# EAGLE design EasyPlanter(V2) (EAGLE 6.5.0)
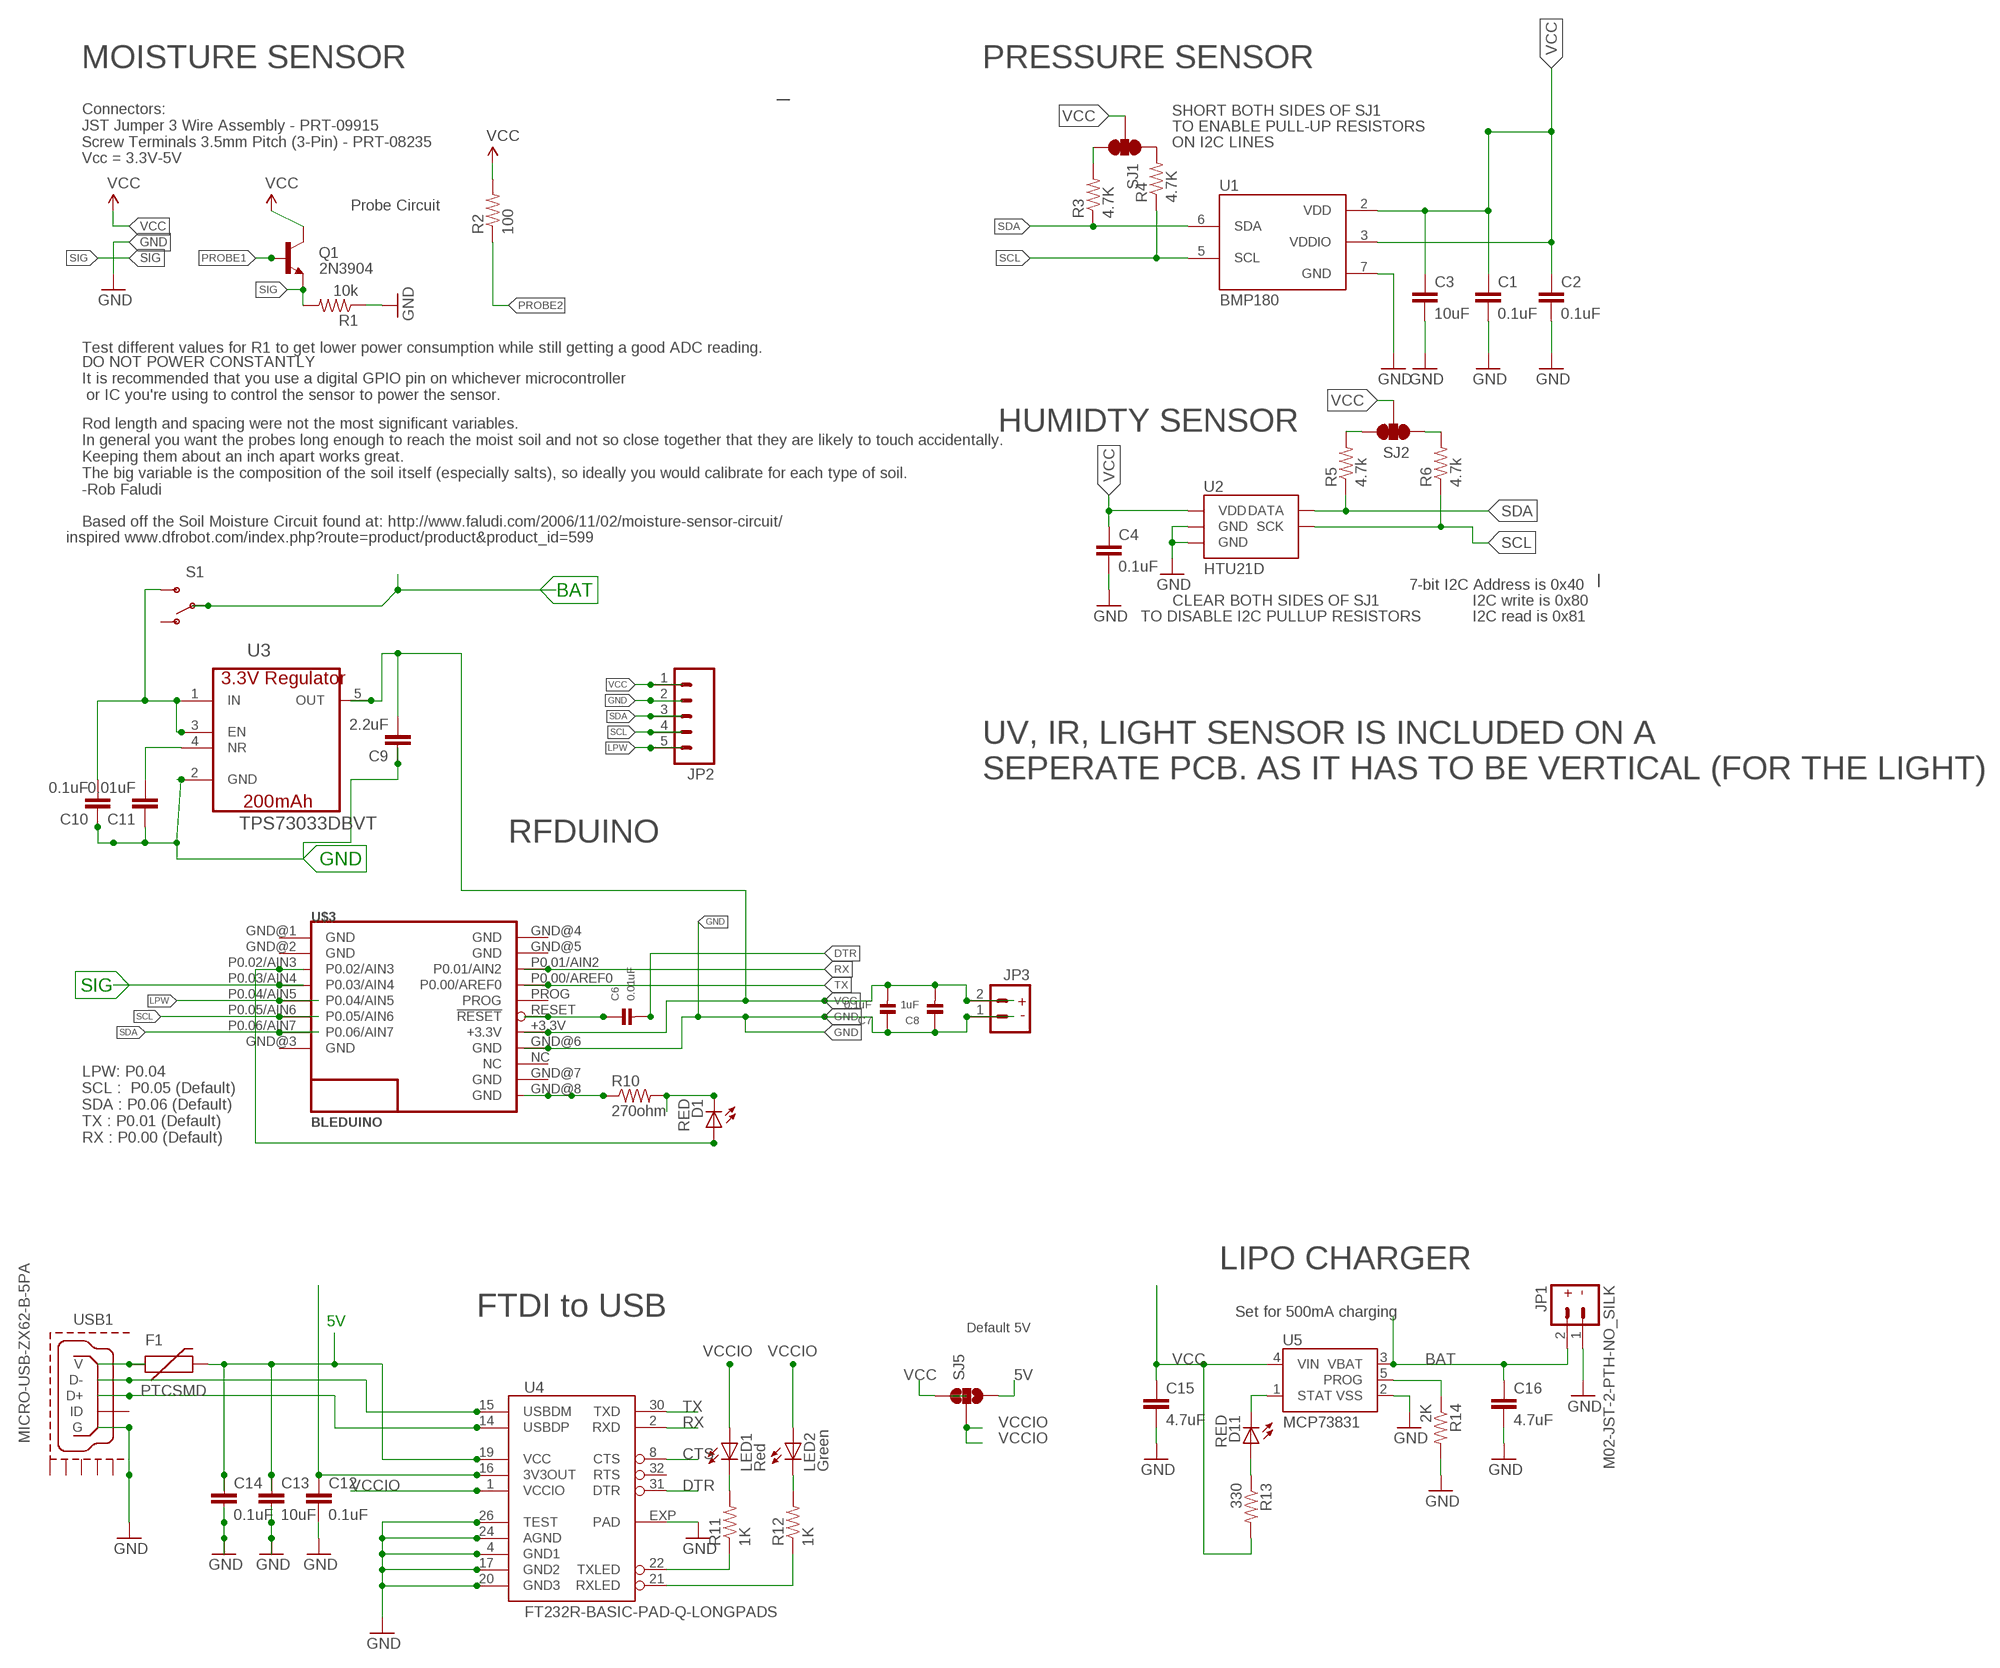
[diagram p0: schematic, sheet 1]

## Parts
C1  0.1uF  CAP0603-CAP  [0603-CAP]
C2  0.1uF  CAP0603-CAP  [0603-CAP]
C3  10uF  CAP0603-CAP  [0603-CAP]
C4  0.1uF  CAP0603-CAP  [0603-CAP]
C6  0.01uF  CAP_CERAMIC0402  [0402]
C7  0.1uF  CAP_CERAMIC0402  [0402]
C8  1uF  CAP_CERAMIC0402  [0402]
C9  2.2uF  CAP0402-CAP  [0402-CAP]
C10  0.1uF  CAP0402-CAP  [0402-CAP]
C11  0.01uF  CAP0402-CAP  [0402-CAP]
C12  0.1uF  CAP-0402  [0402-CAP]
C13  10uF  CAP-0402  [0402-CAP]
C14  0.1uF  CAP-0402  [0402-CAP]
C15  4.7uF  CAP0402-CAP  [0402-CAP]
C16  4.7uF  CAP0402-CAP  [0402-CAP]
D1  RED  LED-RED0603  [LED-0603]
D11  RED  LED0603  [LED-0603]
F1  PTCSMD  [PTC-1206]
JP1  M02-JST-2-PTH-NO_SILK  [JST-2-PTH-NS]
JP2  M05PTH  [1X05]
JP3  M02-JST-2-PTH-NO_SILK  [JST-2-PTH-NS]
LED1  Red  LED0603  [LED-0603]
LED2  Green  LED0603  [LED-0603]
Q1  2N3904  TRANSISTOR_NPNMMBT2222A  [SOT23-3]
R1  10k  100OHM-1/4W-5%(0603)  [0603-RES]
R2  100  100OHM-1/4W-5%(0603)  [0603-RES]
R3  4.7K  RESISTOR0603-RES  [0603-RES]
R4  4.7K  RESISTOR0603-RES  [0603-RES]
R5  4.7k  RESISTOR0603-RES  [0603-RES]
R6  4.7k  RESISTOR0603-RES  [0603-RES]
R10  270ohm  RESISTOR0402-RES  [0402-RES]
R11  1K  RESISTOR-0402  [R0402]
R12  1K  RESISTOR-0402  [R0402]
R13  330  RESISTOR0402-RES  [0402-RES]
R14  2K  RESISTOR0402-RES  [0402-RES]
S1  SWITCH-SPDT-SMD-A  [SWITCH-SPST-SMD-A]
SJ1  SOLDERJUMPER_2WAYPASTE1&2&3  [SJ_3_PASTE1&2&3]
SJ2  SOLDERJUMPER_2WAYPASTE1&2&3  [SJ_3_PASTE1&2&3]
SJ5  SOLDERJUMPER_2WAY-LEFT-BRIDGED  [SJ-3-LEFT]
U1  BMP180  [BMP180]
U2  HTU21D  HTU21DSMD  [HTU21D]
U3  TPS73033DBVT  [SOT95P290X145-5N]
U4  FT232R-BASIC-PAD-Q-LONGPADS  [QFN32-LONG]
U5  MCP73831  [SOT23-5]
U$3  BLEDUINO  [BLEDUINO]
USB1  MICRO-USB-ZX62-B-5PA  [ZX62-B-5PA]

## Nets
5V: C13.1 C14.1 F1.2 SJ5.3 U4.19(VCC)
BAT: C16.1 JP1.2 S1.2(P) U5.3(VBAT)
BAT_INPUT: C10.2 S1.3(S) U3.1(IN) U3.3(EN)
CTS: U4.8(CTS)
DTR: C6.2 U4.31(DTR)
GND: C1.2 C2.2 C3.2 C4.2 C7.1 C8.1 C9.1 C10.1 C11.1 C12.2 C13.2 C14.2 C15.2 C16.2 JP1.1 JP2.2 JP3.1 R1.1 R14.2 U1.7(GND) U2.7(GND) U2.GND U3.2(GND) U4.4(GND1) U4.17(GND2) U4.20(GND3) U4.24(AGND) U4.26(TEST) U4.EXP(PAD) U5.2(VSS) U$3.GND@6(GND) USB1.5(G) USB1.GND@6(GND6)
LPW: JP2.5 U$3.P0.04/AIN5
N$1: R3.2 SJ1.3
N$2: R4.2 SJ1.1
N$3: R5.2 SJ2.3
N$4: R6.2 SJ2.1
N$5: C6.1 U$3.RESET(!RESET)
N$6: D1.A U$3.P0.02/AIN3
N$7: C11.2 U3.4(NR)
N$9: U4.14(USBDP) USB1.3(D+)
N$10: U4.15(USBDM) USB1.2(D-)
N$11: R12.1 U4.21(RXLED)
N$12: R11.1 U4.22(TXLED)
N$13: F1.1 USB1.1(V)
N$14: LED1.C R11.2
N$15: LED2.C R12.2
N$16: D11.A R13.1
N$19: D1.C R10.2
N$35: R10.1 U$3.GND@8(GND)
PROBE1: Q1.1(B)
PROBE2: R2.1
PROG: R14.1 U5.5(PROG)
RX: U4.2(RXD) U$3.P0.01/AIN2
SCL: JP2.4 R4.1 R6.1 U1.5(SCL) U2.SCK U$3.P0.05/AIN6
SDA: JP2.3 R3.1 R5.1 U1.6(SDA) U2.DATA U$3.P0.06/AIN7
SIG: Q1.2(E) R1.2 U$3.P0.03/AIN4
STAT: D11.C U5.1(STAT)
TX: U4.30(TXD) U$3.P0.00/AREF0
VCC: C1.1 C2.1 C3.1 C4.1 C7.2 C8.2 C9.2 C12.1 C15.1 JP2.1 JP3.2 Q1.3(C) R2.2 R13.2 SJ1.2 SJ2.2 SJ5.1 U1.2(VDD) U1.3(VDDIO) U2.VDD U3.5(OUT) U4.16(3V3OUT) U5.4(VIN) U$3.+3.3V
VCCIO: LED1.A LED2.A SJ5.2 U4.1(VCCIO)
Unconnected: S1.1(O) U4.32(RTS) U$3.GND@1(GND) U$3.GND@2(GND) U$3.GND@3(GND) U$3.GND@4(GND) U$3.GND@5(GND) U$3.GND@7(GND) U$3.NC U$3.PROG USB1.4(ID)

## Notes on the sheet
- MOISTURE SENSOR | PRESSURE SENSOR
- SHORT BOTH SIDES OF SJ1
- TO ENABLE PULL-UP RESISTORS
- Connectors: 
  JST Jumper 3 Wire Assembly - PRT-09915
  Screw Terminals 3.5mm Pitch (3-Pin) - PRT-08235
- ON I2C LINES
- Vcc = 3.3V-5V
- Probe Circuit
- Test different values for R1 to get lower power consumption while still getting a good ADC reading.
- DO NOT POWER CONSTANTLY 
  It is recommended that you use a digital GPIO pin on whichever microcontroller
   or IC you're using to control the sensor to power the sensor.
- HUMIDTY SENSOR
- Rod length and spacing were not the most significant variables. 
  In general you want the probes long enough to reach the moist soil and not so close together that they are likely to touch accidentally. 
  Keeping them about an inch apart works great. 
  The big variable is the composition of the soil itself (especially salts), so ideally you would calibrate for each type of soil. 
  -Rob Faludi
- Based off the Soil Moisture Circuit found at: http://www.faludi.com/2006/11/02/moisture-sensor-circuit/
- inspired www.dfrobot.com/index.php?route=product/product&product_id=599
- 7-bit I2C Address is 0x40
- CLEAR BOTH SIDES OF SJ1 | I2C write is 0x80
- TO DISABLE I2C PULLUP RESISTORS | I2C read is 0x81
- UV, IR, LIGHT SENSOR IS INCLUDED ON A
  SEPERATE PCB. AS IT HAS TO BE VERTICAL (FOR THE LIGHT)
- RFDUINO
- LPW: P0.04
  SCL :  P0.05 (Default)
  SDA : P0.06 (Default)
  TX : P0.01 (Default)
  RX : P0.00 (Default)
- LIPO CHARGER
- FTDI to USB | Set for 500mA charging
- 5V
- Default 5V
- VCCIO | VCCIO

## Power pins joined to a net without a drawn wire
GND1: USB1.GND@1(GND1)
GND2: USB1.GND@2(GND2)
GND3: USB1.GND@3(GND3)
GND4: USB1.GND@4(GND4)
GND5: USB1.GND@5(GND5)

## Library data of the parts
C1-C3 = SparkFun-Capacitors:CAP: Capacitor Standard 0603 ceramic capacitor, and 0.1" leaded capacitor.
C4 C9-C11 C15 C16 = SparkFun:CAP: Capacitor Standard 0603 ceramic capacitor, and 0.1" leaded capacitor.
C6-C8 = microbuilder:CAP_CERAMIC: Ceramic Capacitors 0402 - 0402 Surface Mount Capacitors 16pF 50V 5% [Digikey: 445-4899-2-ND] 18pF 50V 5% [Digikey: 490-1281-2-ND] 22pF 50V 5% [Digikey: 490-1283-2-ND] 68pF 50V 5% [Digikey: 490-1289-2-ND] 0.1uF 10V 10% [Digikey: 490-1318-2-ND] 1.0uF 6.3V 10% [Digikey: 490-1320-2-ND] 0603 - 0603 Surface Mount Capacitors 16 pF 50V 5% [Digikey: 445-5051-2-ND] 22 pF 50V [Digikey: PCC220ACVTR-ND] 33 pF 50V 5% [Digikey: 490-1415-1-ND] 56pF 50V 5% [Digikey: 490-1421-1-ND] 220pF 50V 5% [Digikey: 445-1285-1-ND] 680 pF 50V 2200 pF 50V 5% C0G [Digikey: 445-1297-1-ND] 5600 pF 100V 5% X7R [Digikey: 478-3711-1-ND] 0.1 µF 25V 10% [Digikey: PCC2277TR-ND] 0.22 µF 16V 10% X7R [Digikey: 445-1318-1-ND] 1.0 µF 25V 10% [Digikey: 445-5146-2-ND] 0603 - RF Specific 3pF 250V +/-0.1pF RF [Digikey: 712-1347-1-ND] 18 pF 250V 5% [Digikey: 478-3505-1-ND or 712-1322-1-ND] 56 pF 250V 5% C0G RF [Digikey: 490-4867-1-ND] 68 pF 250V RF [Digikey: 490-4868-1-ND] 0805 - 0805 Surface Mount Capacitors 220 pF 250V 2% RF Ceramic Capacitor [Digikey: 712-1398-1-ND] 1000 pF 50V 2% NP0 Ceramic Capacitor [Digikey: 478-3760-1-ND] 0.1 µF 25V 10% Ceramic Capacitor [Digikey: PCC1828TR-ND] 1.0 µF 16V 10% Ceramic Capacitor[Digikey: 490-1691-2-ND] 10.0 µF 10V 10% Ceramic Capacitor[Digikey: 709-1228-1-ND] 10.0 uF 16V 10% Ceramic Capacitor [Digikey: 478-5165-2-ND] 47 uF 6.3V 20% Ceramic Capacitor [Digikey: 587-1779-1-ND or 399-5506-1-ND] 1206 - 1206 Surface Mount Capacitors 47uF 10V 20% Ceramic Capacitor [Digikey: 490-5528-1-ND or 399-5508-1-ND or 445-6010-1-ND] 100uF 6.3V -20%, +80% Y5V Ceramic Capacitor (Digikey: 490-4512-1-ND, Mouser: 81-GRM31CF50J107ZE1L)
C12-C14 = akafugu:CAP: Capacitor Standard 0603 ceramic capacitor, and 0.1" leaded capacitor.
D1 = SparkFun-LED:LED-RED: Assorted Red LEDs LilyPad 1206- DIO-09912 1206- DIO-00809 0603- DIO-00819; PROD_ID: DIO-00819
D11 = SparkFun:LED: LEDs Standard schematic elements and footprints for 5mm, 3mm, 1206, and 0603 sized LEDs. 5mm - Spark Fun Electronics SKU : COM-00529 (and others)
F1 = akafugu:PTC: Resettable Fuse PTC Resettable Fuse. Spark Fun Electronics SKU : COM-08357
JP1 JP3 = SparkFun-Connectors:M02: Standard 2-pin 0.1" header. Use with - straight break away headers ( PRT-00116) - right angle break away headers (PRT-00553) - swiss pins (PRT-00743) - machine pins (PRT-00117) - female headers (PRT-00115) Molex polarized connector foot print use with: PRT-08233 with associated crimp pins and housings. 2.54_SCREWTERM for use with PRT-10571. 3.5mm Screw Terminal footprints for PRT-08084 5mm Screw Terminal footprints for use with PRT-08433
JP2 = SparkFun-Connectors:M05: Header 5 Standard 5-pin 0.1" header. Use with straight break away headers (SKU : PRT-00116), right angle break away headers (PRT-00553), swiss pins (PRT-00743), machine pins (PRT-00117), and female headers (PRT-00115). Molex polarized connector foot print use with SKU : PRT-08230 with associated crimp pins and housings.
LED1 LED2 = akafugu:LED: LEDs Standard schematic elements and footprints for 5mm, 3mm, 1206, and 0603 sized LEDs. 5mm - Spark Fun Electronics SKU : COM-00529 (and others)
Q1 = SparkFun-DiscreteSemi:TRANSISTOR_NPN: Generic NPN BJT MMBT2222A - TRANS-08049 (SOT-23, 1A 40V) MPSA42 - TRANS-09116 (SOT-23, 500mA 300V) MMBT5088LT1G - TRANS-11160 (SOT-23, 50 mA 30V) BC547 - COM-08928 <http://www.sparkfun.com/products/8928> (TO-92 45V 100mA) (1.Collector 2.Base 3.Emitter) 2N3904 - COM-00521 <http://www.sparkfun.com/products/521> (TO-92 40V 200mA) (1.Emitter 2.Base 3.Collector) P2N2222A - COM-12852 <http://www.sparkfun.com/products/12852> (TO-92 40V 600mA) (1.Collector 2.Base 3.Emitter); PROD_ID: TRANS-08049; VALUE: MMBT2222A
R1 R2 = SparkFun-Resistors:100OHM-1/4W-5%(0603); PROD_ID: RES-12438; VALUE: 100/.25W
R3 R4 R10 = SparkFun-Passives:RESISTOR: Resistor Basic schematic elements and footprints for 0603, 1206, and PTH resistors.
R5 R6 R13 R14 = SparkFun:RESISTOR: Resistor Basic schematic elements and footprints for 0603, 1206, and PTH resistors.
R11 R12 = akafugu:RESISTOR: Resistor Basic schematic elements and footprints for 0603, 1206, and PTH resistors.
S1 = SparkFun-Electromechanical:SWITCH-SPDT: SPDT Switch Simple slide switch, Spark Fun Electronics SKU : COM-00102 DPDT SMT slide switch, AYZ0202, SWCH-08179
SJ1 SJ2 = mike-temp:SOLDERJUMPER_2WAY: Solder Jumper 2 way solder jumper
SJ5 = akafugu:SOLDERJUMPER_2WAY: Solder Jumper 2 way solder jumper
U1 = SparkFun-Sensors:BMP180: BOSCH BMP180 DIGITAL BAROMETRIC PRESSURE SENSOR Web page: http://www.bosch-sensortec.com/en/homepage/products_3/environmental_sensors_1/bmp180_1/bmp180 Datasheet: http://ae-bst.resource.bosch.com/media/products/dokumente/bmp180/BST-BMP180-DS000-09.pdf The BMP180 is the function compatible successor of the BMP085, a new generation of high precision digital pressure sensors for consumer applications. The ultra-low power, low voltage electronics of the BMP180 is optimized for use in mobile phones, PDAs, GPS navigation devices and outdoor equipment. With a low altitude noise of merely 0.25m at fast conversion time, the BMP180 offers superior performance. The I2C interface allows for easy system integration with a microcontroller. The BMP180 is based on piezo-resistive technology for EMC robustness, high accuracy and linearity as well as long term stability. Key features: - Temperature measurement included - I2C interface - Fully calibrated - Pb-free, halogen-free and RoHS compliant, - MSL 1 Basic specs: Pressure range: 300 to 1100hPa (+9000m to -500m relating to sea level) Supply voltage: 1.8 to 3.6V (VDD), 1.62V to 3.6V (VDDIO) Package: LGA package with metal lid Small footprint: 3.6mm x 3.8mm Super-flat: 0.93mm height Low power: 5μA at 1 sample / sec. in standard mode Low noise: 0.06hPa (0.5m) in ultra low power mode, 0.02hPa (0.17m) advanced resolution mode Typical applications: - Enhancement of GPS navigation (dead-reckoning, slope detection, etc.) - In- and out-door navigation - Leisure and sports - Weather forecast - Vertical velocity indication (rise/sink speed)
U2 = SparkFun-Sensors:HTU21D
U3 = UniqueInteractionsLib:TPS73033DBVT: V REG LDO 0.2A +3.3V, SOT-23-5; MPN: TPS73033DBVT; OC_FARNELL: 1135395; OC_NEWARK: 71J8233; PACKAGE: SOT-23-5; SUPPLIER: TEXAS INSTRUMENTS
U4 = akafugu:FT232R-BASIC-PAD
U5 = SparkFun:MCP73831: Microchip's MCP73831 Miniature single cell, fully integrated Li-Ion, Li-polymer charge management controller http://ww1.microchip.com/downloads/en/DeviceDoc/21984a.pdf
U$3 = UniqueInteractionsLib:BLEDUINO
USB1 = serial:MICRO-USB: MICRO USB B, BOTTOM MOUNT

## Board
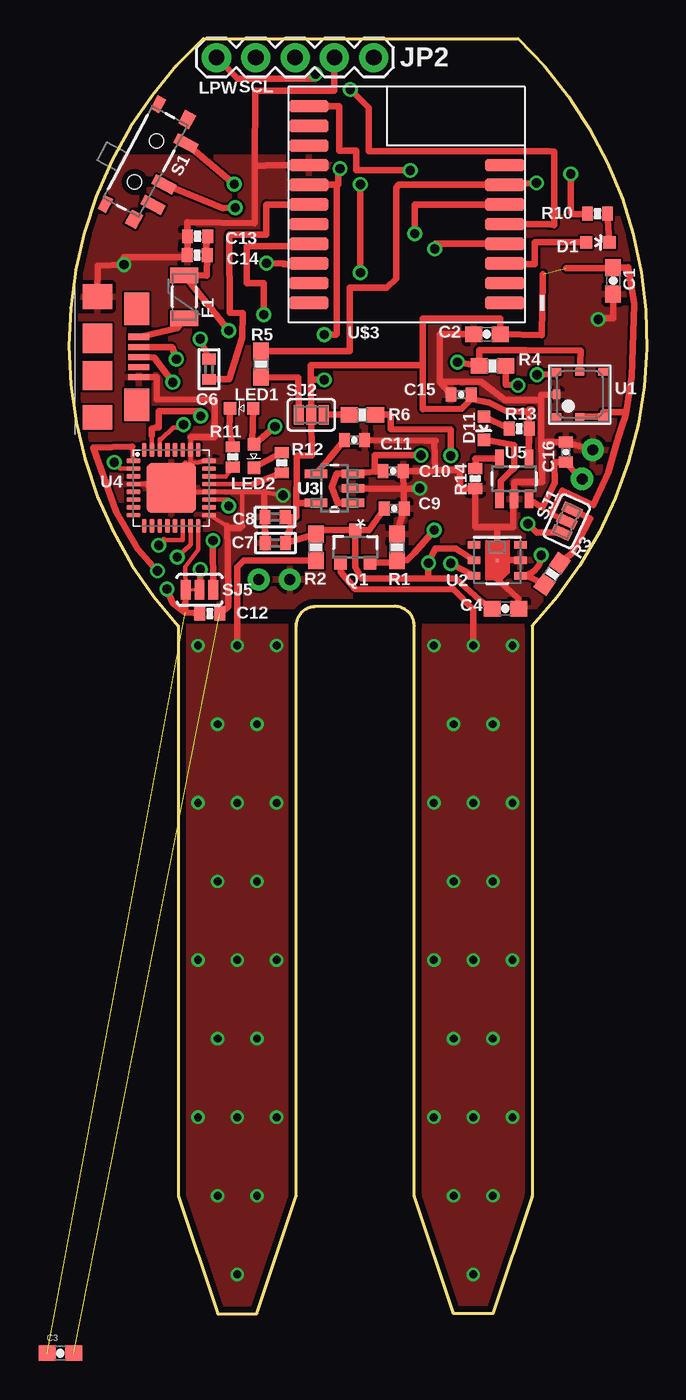
[diagram p1: board, top side]
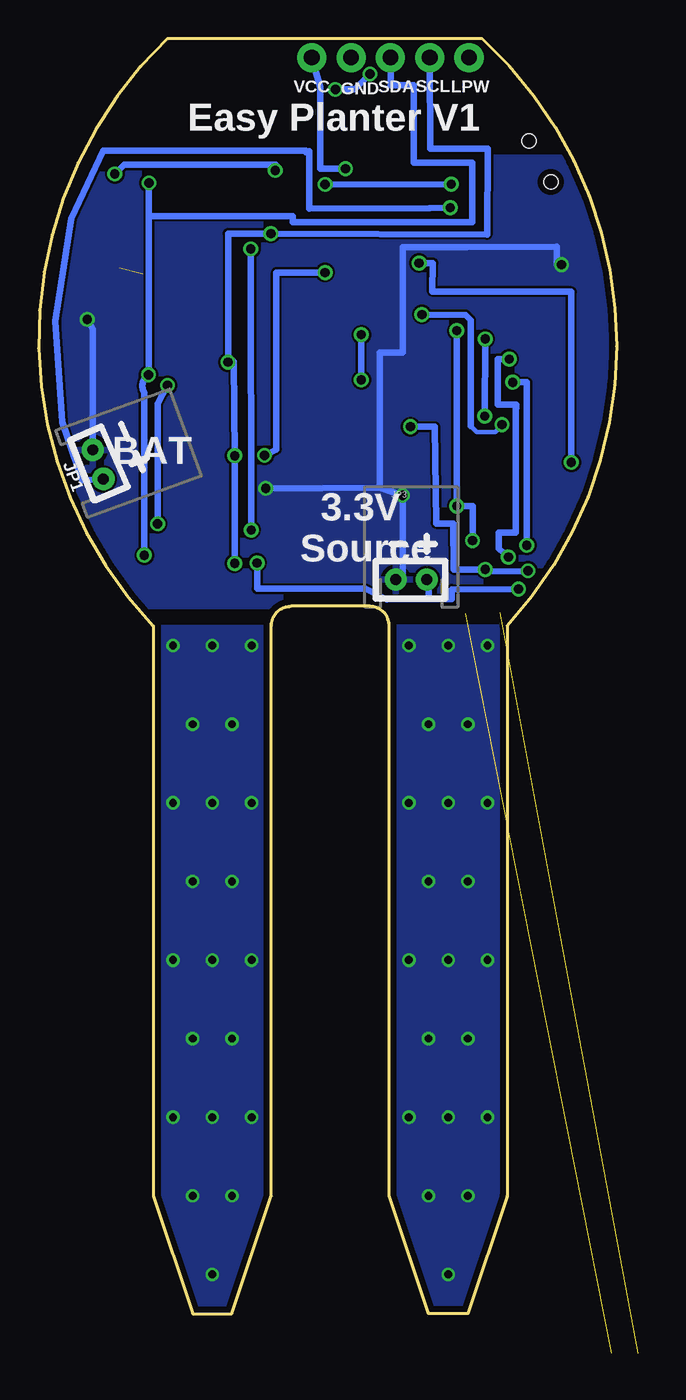
[diagram p2: board, bottom side, seen from below]

Size 37.33 x 82.4 mm. Coordinates in mm from the lower left corner, seen from the top.
Outline: 8.7,82.4 arc90 7.07,44.45 7.07,7.62 9.61,0 12.15,0 14.69,7.62 14.69,44.45 arc-90 15.96,45.72 21.04,45.72 arc-90 22.31,44.45 22.31,7.62 24.85,0 27.39,0 29.93,7.62 29.93,44.45 arc90 29.02,82.4 8.7,82.4
Copper layers (1*16): Top 0.0356mm / dielectric 1.5011mm / Bottom 0.0356mm
Design rules "oshParkPCBDesignRules": minimum track width 6mil, minimum drill 13mil, track to track 6mil, track to pad 6mil, pad to pad 6mil, via to via 6mil, smd to smd 6mil, copper to edge 15mil, drill to drill 6mil, minimum pad ring 7mil, minimum via ring 7mil, stop-mask expansion 3mil, vias tented up to drill 0mil, thermal gap 10mil
tRestrict: area 3.3,74.9 to 35,82.6
bRestrict: area 3.3,74.9 to 35,82.6

### Footprints (pad centres in the part's own frame; a part is rotated, then mirrored left to right if it is on the bottom)
0603-CAP = smd 1.1 x 1: 1 -0.85,0; 2 0.85,0
0402 = smd 0.7 x 0.9: 1 -0.65,0; 2 0.65,0
0402-CAP = smd 0.7 x 0.9: 1 -0.65,0; 2 0.65,0
LED-0603 = smd 0.8 x 0.8: A 0,-0.75; C 0,0.75
PTC-1206 = smd 1 x 1.8: 1 -1.4,0; 2 1.4,0
JST-2-PTH-NS = drill 0.7 pad 1.448: 1 -1,0; 2 1,0
1X05 = drill 1.016 pad 1.88: 1 0,0; 2 2.54,0; 3 5.08,0; 4 7.62,0; 5 10.16,0
LED-0603' = smd 0.8 x 0.8: A -0.75,0; C 0.75,0
SOT23-3 = smd 0.8 x 0.9: 1 -0.95,-1; 2 0.95,-1; 3 0,1.1
0603-RES = smd 1.1 x 1: 1 -0.85,0; 2 0.85,0
0402-RES = smd 0.7 x 0.9: 1 -0.65,0; 2 0.65,0
R0402 = smd 0.7 x 0.9: 1 -0.65,0; 2 0.65,0
SWITCH-SPST-SMD-A = smd 0.7 x 1.5: 1 -2.25,-1.75; 2 -0.75,-1.75; 3 2.25,-1.75 | smd 1 x 0.6: GND1 -3.65,1; GND3 3.65,1 | smd 1 x 0.8: GND2 -3.65,-1.1; GND4 3.65,-1.1 | hole 0.9: -1.5,0; 1.5,0
SJ_3_PASTE1&2&3 = smd 0.635 x 1.27: 1 -0.813,0; 2 0,0; 3 0.813,0
SJ-3-LEFT = smd 0.635 x 1.27: 1 -0.889,0; 2 0,0; 3 0.889,0
BMP180 = smd 0.6 x 0.5: 1 1.5,1.45; 2 0,1.45; 3 -1.5,1.45; 4 -1.5,-1.45; 5 0,-1.45; 6 1.5,-1.45 | smd 0.5 x 0.6: 7 1.5,0
HTU21D = smd 0.2 x 0.2: 7 0,0 | smd 0.8 x 0.5: DATA 1.5,-1; GND 1.5,0; NC@1 -1.5,1; NC@6 1.5,1; SCK -1.5,-1; VDD -1.5,0
SOT95P290X145-5N = smd 1.473 x 0.559: 1 -1.194,0.94; 2 -1.194,0; 3 -1.194,-0.94; 4 1.194,-0.94; 5 1.194,0.94
QFN32-LONG = smd 0.9 x 0.3: 1 -2.45,1.75; 2 -2.45,1.25; 3 -2.45,0.75; 4 -2.45,0.25; 5 -2.45,-0.25; 6 -2.45,-0.75; 7 -2.45,-1.25; 8 -2.45,-1.75; 17 2.45,-1.75; 18 2.45,-1.25; 19 2.45,-0.75; 20 2.45,-0.25; 21 2.45,0.25; 22 2.45,0.75; 23 2.45,1.25; 24 2.45,1.75 | smd 0.3 x 0.9: 9 -1.75,-2.45; 10 -1.25,-2.45; 11 -0.75,-2.45; 12 -0.25,-2.45; 13 0.25,-2.45; 14 0.75,-2.45; 15 1.25,-2.45; 16 1.75,-2.45; 25 1.75,2.45; 26 1.25,2.45; 27 0.75,2.45; 28 0.25,2.45; 29 -0.25,2.45; 30 -0.75,2.45; 31 -1.25,2.45; 32 -1.75,2.45 | smd 3.2 x 3.2: EXP 0,0
SOT23-5 = smd 0.55 x 1.2: 1 -0.95,-1.3; 2 0,-1.3; 3 0.95,-1.3; 4 0.95,1.3; 5 -0.95,1.3
BLEDUINO = smd 2.54 x 0.813: +3.3V 6.331,-2.54; GND@1 -6.331,5.08; GND@2 -6.331,3.81; GND@3 -6.331,-3.81; GND@4 6.331,5.08; GND@5 6.331,3.81; GND@6 6.331,-3.81; GND@7 6.331,-6.35; GND@8 6.331,-7.62; NC 6.331,-5.08; P0.00/AREF0 6.331,1.27; P0.01/AIN2 6.331,2.54; P0.02/AIN3 -6.331,2.54; P0.03/AIN4 -6.331,1.27; P0.04/AIN5 -6.331,0; P0.05/AIN6 -6.331,-1.27; P0.06/AIN7 -6.331,-2.54; PROG 6.331,0; RESET 6.331,-1.27
ZX62-B-5PA = smd 0.4 x 1.35: 1 -1.3,2.675; 2 -0.65,2.675; 3 0,2.675; 4 0.65,2.675; 5 1.3,2.675 | smd 2.1 x 1.6: GND@1 -3.1,2.55; GND@2 3.1,2.55 | smd 1.6 x 1.9: GND@3 3.9,0; GND@6 -3.9,0 | smd 1.9 x 1.9: GND@4 1.2,0; GND@5 -1.2,0

### Placement (x,y rotation side)
C1  35.16,66.75 270 top
C2  27.01,63.3 180 top
C3  -0.55,-2.54 0 top
C4  28.2,45.57 0 top
C6  9.05,61.04 90 top
C7  13.34,49.81 0 top
C8  13.32,51.49 0 top
C9  21.02,52.04 180 top
C10  20.94,54.46 180 top
C11  18.45,56.46 180 top
C12  9.1,45.24 0 top
C13  8.32,69.62 180 top
C14  8.29,68.4 180 top
C15  25.33,59.39 180 top
C16  32.09,55.68 90 top
D1  34.17,69.24 270 top
D11  26.81,57.23 180 top
F1  7.45,65.71 90 top
JP1  33.5,54.89 290 bottom
JP2  19.69,81.18 180 top
JP3  13.27,47.45 0 bottom
LED1  Red  [LED-0603']  11.16,58.52 180 top
LED2  Green  [LED-0603']  11.95,55.42 270 top
Q1  18.5,49.53 0 top
R1  21.19,49.53 270 top
R2  15.96,49.53 90 top
R3  31.22,47.81 55 top
R4  27.37,61.24 0 top
R5  12.4,61.37 270 top
R6  18.96,58.09 180 top
R10  34.15,71.09 0 top
R11  10.58,55.37 90 top
R12  13.75,54.99 90 top
R13  29.09,57.2 0 top
R14  26.25,53.98 270 top
S1  4.95,74.47 62 top
SJ1  32.17,51.22 65 top
SJ2  15.66,58.09 180 top
SJ5  8.44,46.79 0 top
U1  33,59.41 180 top
U2  27.67,48.69 0 top
U3  17.15,53.34 180 top
U4  6.61,53.37 0 top
U5  28.76,53.95 0 top
U$3  21.83,70.41 180 top
USB1  1.84,61.82 270 top

### Tracks (layer width: path | path; a pad name or v marks a point on that pad's centre or on a via)
5V  (via drill 0.6)
  Top 0.305: U4.19 10.3,52.6 10.3,52.2
  Top 0.406: C13.1 8.89,68.99 C14.1 8.9,67.09 F1.2 v10.32,63.52 | 10.3,52.2 v10.32,52.2 | SJ5.3 v9.31,49.96
  Bottom 0.406: v10.32,63.52 v10.32,52.2 9.31,52.2 v9.31,49.96
BAT  (via drill 0.6)
  Top 0.406: JP1.2 32.92,54.13 C16.1 31.37,55.04 31.38,53.7 30.58,52.09 U5.3 | S1.2 9.93,71.45 v10.75,71.48
  Bottom 0.406: v10.75,71.48 12.07,71.45 19.87,71.43 19.87,75.13 20.08,75.06 20.08,75.16 33.16,75.16 35.24,70.76 36.28,64.14 35.8,57.63 34.53,53.87 JP1.2
BAT_INPUT  (via drill 0.6)
  Top 0.406: U3.1 17.38,52.4 16.98,53.42 17.31,54.28 U3.3 C10.2 19.75,54.42 19.77,55.5 v22.74,55.47 | S1.3 v10.68,73 | v18.83,72.97 v18.83,67.29
  Bottom 0.406: v10.68,73 v18.83,72.97 | v18.83,67.29 21.98,67.29 21.98,55.85 v22.74,55.47
DTR  (via drill 0.6)
  Top 0.305: U4.31 5.37,56.74
  Top 0.406: 5.37,56.74 5.37,57.2 5.62,57.25 5.8,57.25 5.8,58.34 8.49,58.34 8.49,58.01 v8.52,58.01 | v8.49,62.99 C6.2
  Bottom 0.406: v8.52,58.01 v8.49,62.99
GND  (via drill 0.6)  (1 unrouted)
  Top 0.305: 10.22,50.9 U4.17 | 11.19,50.9 11.19,53.11 | 11.19,53.11 10.08,53.11 10.08,53.12 U4.20 7.88,53.11 7.63,53.37 U4.EXP | U4.24 8.65,55.09 8.37,54.99 7.86,54.98 | 7.86,54.98 7.5,54.94 | U4.4 5.01,53.62 | 7.86,56.64 U4.26 7.86,54.98 | 11.19,53.11 12.63,53.11 v13.83,52.88
  Top 0.406: C15.2 23.97,60.24 | 23.97,60.24 23.97,63.3 C2.2 | USB1.GND@6 1.85,67.74 v3.57,67.79 3.54,68.28 7.64,68.28 | C14.2 7.46,68.17 7.64,68.28 | 7.64,68.28 C13.2 7.65,70.54 12,70.48 12.02,74.2 | C12.2 10.28,45.7 10.27,49.33 10.22,50.78 | 10.22,50.78 10.22,50.9 | R1.1 C9.1 21.62,53 | 21.62,53 C10.1 | C10.1 21.14,54.33 | C11.1 23.02,56.41 23.68,56.41 23.61,56.34 23.68,54.48 | 27.67,50.85 26.25,50.85 R14.2 25.25,53.32 25.26,53.42 25.26,54.51 23.68,54.51 23.68,54.48 | 27.67,50.85 28.71,50.85 28.71,52.65 U5.2 28.76,53.75 30.57,53.75 30.51,56.33 | U2.7 27.67,50.85 | U2.GND U2.7 | C4.2 29.02,46.23 27.49,47.62 U2.7 | JP1.1 C16.2 30.51,56.33 | U1.7 30.51,59.41 | 30.51,59.41 30.51,56.33 | 30.51,59.41 30.52,59.03 28.25,59.03 28.18,59.05 26.6,60.25 23.97,60.24 | C1.2 35.16,64.33 34.2,64.34 v34.2,64.26 | U3.2 21.6,53.33 | 21.6,53.33 21.62,53 | 7.5,54.94 U4.EXP 5.01,53.62 | USB1.5 5.67,60.52 5.67,59.11 9.43,59.08 9.43,56.64 7.86,56.64 | v22.67,53.34 21.6,53.33 | JP2.2 17.13,79.02 12.02,79.02 12.02,74.2 | C7.1 C8.1 12.63,51.45 12.63,53.11 | U$3.GND@6 12.79,74.22 12.66,74.2 12.02,74.2 | 23.68,54.48 23.45,54.46 C10.1 | 11.19,50.9 11.09,50.78 10.22,50.78
  Bottom 0.406: v34.2,64.26 33.84,63.63 JP1.1 | 15.3,53.38 v13.83,52.88 13.83,47.45 JP3.1 | 15.3,53.38 v22.67,53.34 | v3.57,67.79 3.87,67.79 3.87,68.96 9.64,68.94 13.8,68.91 13.8,62.1 15.3,62.1 15.3,60.83 15.3,53.38
  pour Bottom: -1.82,45.72 -1.82,74.93 36.28,74.93 36.28,45.72
  pour Top: -3.09,45.72 -3.09,74.93 36.28,74.93 36.28,45.72
LPW  (via drill 0.6)
  Top 0.406: JP2.5 10.91,79.81 15.94,79.81 v15.94,80.11 | v18.17,79.12 19.36,77.93 19.36,75.13 31,75.13 31.35,75.08 31.35,70.36 31,70.41 U$3.P0.04/AIN5
  Bottom 0.406: v15.94,80.11 16.93,79.12 v18.17,79.12
N$1
  Top 0.406: R3.2 32.47,49.11 32.93,49.96 33.66,51.37 SJ1.3
N$2  (via drill 0.6)
  Top 0.406: SJ1.1 30.22,50.48 v29.65,51.05 | v29.02,59.99 28.23,60.03 R4.2
  Bottom 0.406: v29.65,51.05 29.65,58.83 v29.02,59.99
N$3
  Top 0.406: R5.2 14.82,60.49 SJ2.3
N$4
  Top 0.406: R6.2 SJ2.1
N$5
  Top 0.406: C6.1 10.37,60.4 11.21,63.09 11.24,64.67 10.4,64.69 10.37,69.44 10.37,69.75 12.76,69.75 12.76,71.68 | 12.76,71.68 12.81,71.65 | 12.76,71.68 U$3.RESET
N$6
  Top 0.406: D1.A 30.08,69.24 30.08,67.82 28.76,67.82 U$3.P0.02/AIN3
N$7
  Top 0.406: C11.2 16.77,55.22 U3.4
N$9  (via drill 0.6)
  Top 0.305: 6.13,50.01 7.35,50.01 U4.14
  Top 0.406: USB1.3 5.52,61.77 v6.71,60.2 | v5.8,49.66 6.13,50.01
  Bottom 0.406: v6.71,60.2 5.8,60.2 v5.8,49.66
N$10  (via drill 0.6)
  Top 0.305: U4.15 7.86,49.71 v6.99,48.89
  Top 0.406: v6.94,61.7 6.66,62.46 USB1.2
  Bottom 0.406: v6.99,48.89 7.6,49.45 7.6,50.49 6.51,50.47 6.51,58.52 6.49,58.52 6.49,58.75 7.68,58.75 7.68,61.7 v6.94,61.7
N$11
  Top 0.305: 11.92,53.62 U4.21
  Top 0.406: R12.1 11.92,53.62
N$12
  Top 0.305: U4.22 10.12,54.1 R11.1
N$13
  Top 0.406: USB1.1 6.99,63.68 F1.1
N$14
  Top 0.406: R11.2 10.37,57.23 LED1.C
N$15
  Top 0.406: R12.2 LED2.C
N$16
  Top 0.406: D11.A R13.1
N$19
  Top 0.406: R10.2 34.82,70.71 D1.C
N$35  (via drill 0.6)
  Top 0.406: v22.06,73.89 18.55,73.89 18.55,75.16 17.46,75.16 17.46,78.03 U$3.GND@8 | R10.1 33.47,71.07 32.47,71.07 32.42,71.15 v32.42,73.66
  Bottom 0.406: v32.42,73.66 31.81,74.24 22.01,74.24 22.08,74.17 v22.06,73.89
PROBE1  (via drill 0.51)
  Top 0.406: Q1.1 17.55,47.94 18.5,46.84 24.85,46.79 26.12,45.52 v26.12,43.18
  other vias: 23.58,43.18 28.66,43.18 28.66,33.02 26.12,33.02 23.58,33.02 23.58,22.86 26.12,22.86 28.66,22.86 28.66,12.7 26.12,12.7 23.58,12.7 24.85,7.62 27.39,7.62 26.12,2.54 24.85,38.1 27.39,38.1 27.39,27.94 24.85,27.94 24.85,17.78 27.39,17.78
  pour Top: 22.31,44.45 22.31,0 29.93,0 29.93,44.45
  pour Bottom (isolate 0.305): 22.31,44.45 22.31,0 29.93,0 29.93,44.45
PROBE2  (via drill 0.51)
  Top 0.406: v10.88,43.18 10.88,48.26 11.3,48.68 R2.1
  other vias: 13.42,43.18 8.34,43.18 8.34,33.02 10.88,33.02 13.42,33.02 13.42,22.86 10.88,22.86 8.34,22.86 8.34,12.7 10.88,12.7 13.42,12.7 12.15,7.62 9.61,7.62 10.88,2.54 9.61,17.78 12.15,17.78 9.61,27.94 12.15,27.94 9.61,38.1 12.15,38.1
  pour Top: 7.07,44.45 7.07,0 14.69,0 14.69,44.45
  pour Bottom: 7.07,44.45 7.07,0 14.69,0 14.69,44.45
PROG
  Top 0.406: U5.5 27.87,55.27 26.25,55.27 26.27,55.24 R14.1
RX  (via drill 0.6)
  Top 0.305: U4.2 3.33,54.62 v2.93,55.02
  Top 0.406: v12.76,67.89 13.9,67.87 13.85,67.84 15.5,67.84 U$3.P0.01/AIN2
  Bottom 0.406: v2.93,55.02 2.93,66.04 11.9,66.06 11.87,67.89 v12.76,67.89
SCL  (via drill 0.6)
  Top 0.406: U1.5 33.03,61.49 33.05,62.26 29.5,62.28 26.5,62.28 R4.1 v25.1,61.49 | U2.SCK v24.67,48.49 | v24.67,55.45 24.67,57.15 20.79,57.17 20.79,58.09 R6.1 | U$3.P0.05/AIN6 22.34,71.68 v22.34,69.8
  Bottom 0.406: v24.67,48.49 v24.67,55.45 24.72,61.54 v25.1,61.49 25.1,69.8 v22.34,69.8 8.37,69.75 8.34,75.29 12.05,75.29 JP2.4
SDA  (via drill 0.6)
  Top 0.406: R3.1 29.78,47.62 U2.DATA 29.18,47.69 arc90 v30.51,49.02 | v30.24,60.68 31.53,60.71 U1.6 | v30.21,73.08 U$3.P0.06/AIN7 21.32,72.95 21.14,72.77 21.14,66.9 20.53,66.29 18.14,66.29 18.14,66.19 18.14,62.2 14.17,62.2 R5.1
  Bottom 0.406: v30.51,49.02 30.51,59.51 arc90 v30.24,60.68 30.21,70.92 | 30.24,73.23 v30.21,73.08 30.21,70.92 | JP2.3 14.59,79.38 13.09,79.38 13.09,74.4 9.33,74.4 9.33,70.54 20.91,70.54 20.91,70.92 30.21,70.92
SIG  (via drill 0.6)
  Top 0.254: 20.89,48.53 R1.2 21.05,48.69
  Top 0.406: Q1.2 20.89,48.53 | 21.05,48.69 21.85,48.69 22.31,49.15 v23.61,50.65 | U$3.P0.03/AIN4 23.68,69.14 23.68,68.81 v23.63,68.81
  Bottom 0.406: v23.63,68.81 23.63,68.2 v23.61,50.65
STAT
  Top 0.406: D11.C 28.76,56.13 28.76,54.63 28.58,54.48 27.9,53.8 27.87,52.71 U5.1
TX  (via drill 0.6)
  Top 0.305: U4.30 5.88,55.81 5.88,56.52 5.98,56.52 6.74,57.28 7.43,57.28 v7.4,57.45
  Top 0.406: v12.58,64.57 12.58,66.6 11.49,66.6 11.49,68.99 15.5,68.99 U$3.P0.00/AREF0
  Bottom 0.305: v7.4,57.45 7.5,57.3 7.83,56.97 9.05,56.97 9.43,57.35
  Bottom 0.406: 9.43,57.35 9.43,64.21 9.76,64.54 v12.58,64.57
VCC  (via drill 0.6)  (2 unrouted)
  Top 0.254: R2.2 16.21,50.63
  Top 0.305: U4.16 8.36,49.63 8.37,49.38 7.53,48.26 SJ5.1
  Top 0.406: 16.21,50.63 Q1.3 | C12.1 8.1,45.28 7.52,45.31 | R2.2 C7.2 14.49,51.49 14.69,51.48 | Q1.3 19.39,50.63 19.39,50.65 C9.2 | C4.1 26.58,46.08 25,47.5 23.2,47.52 | U2.VDD 25,49.45 23.66,49.45 v23.22,48.51 23.2,47.52 | Q1.3 18.5,48.26 18.91,47.5 23.2,47.52 | C8.2 14.69,51.48 | 14.69,51.48 14.72,55.45 15.68,55.45 SJ2.2 15.63,60.38 | v6.33,46.84 6.71,45.92 7.52,45.31 | SJ5.1 7.52,45.31 | v16.49,63.27 17.26,63.27 17.31,63.35 17.31,73 U$3.+3.3V 17.38,72.95 17.41,72.97 17.41,73.99 v17.51,73.99 | U3.5 14.69,52.4 14.69,51.48 | 32.14,67.56 35.34,67.56 | 35.34,67.56 35.26,67.79 35.44,67.95 | 35.34,67.56 C1.1 36.13,67.6 36.13,67.64 36.51,65.25 36.36,60.55 36,58.27 | 30.62,67.19 30.62,66.8 30.54,63.24 C2.1 27.86,64.31 22.84,64.31 22.84,61.32 | U1.2 U1.3 34.5,58.27 36,58.27 | SJ1.2 31.15,51.69 31.86,53.19 33.87,52.25 34.83,54.36 35.32,56.08 arc-6 35.95,57.96 36,58.27 | 29.93,58.42 29.71,58.42 U5.4 R13.2 29.7,57.34 29.7,58.29 28.3,58.29 27.16,58.88 25.98,59.09 | 15.63,60.38 15.63,61.32 22.84,61.32 | C15.1 25.98,59.09 | 25.98,59.09 25.38,58.5 22.84,58.47 22.84,61.32 | 15.63,60.38 v16.49,60.35
  Bottom 0.406: v23.22,48.51 23.22,46.86 16.24,46.86 14.84,46.15 12.15,46.2 | 12.15,46.2 10.65,46.2 10.65,46.81 v6.33,46.84 | v16.49,60.35 v16.49,63.27 | JP2.1 19.14,79.27 19.14,73.99 v17.51,73.99 | JP3.2 12.15,47.45 12.15,46.2
VCCIO  (via drill 0.6)
  Top 0.305: U4.1 4.08,56.03
  Top 0.406: LED1.A 11.85,56.34 11.85,56.15 LED2.A v13.32,57.33 | 4.08,56.03 1.58,55.98 3.06,51.82 4.45,49.4 v5.72,48.01 | SJ5.2 8.49,46.83 v8.49,48.1
  Bottom 0.406: 5.83,47.98 v5.72,48.01 5.72,47.98 5.83,47.98 | v13.32,57.33 11.74,57.33 11.67,51.08 10.55,51.08 10.52,48.11 10.09,48.08 v8.49,48.1 | v8.49,48.1 8.34,47.98 | 8.34,47.98 5.83,47.98 | v8.49,48.1 8.48,47.98 8.34,47.98

### Text on the board
tNames: LPW | SCL
bNames: LPW | SCL | SDA | GND | VCC | Easy Planter V1 | BAT | 3.3V / Source